# EAGLE design Sensor_Board (EAGLE 9.6.2)
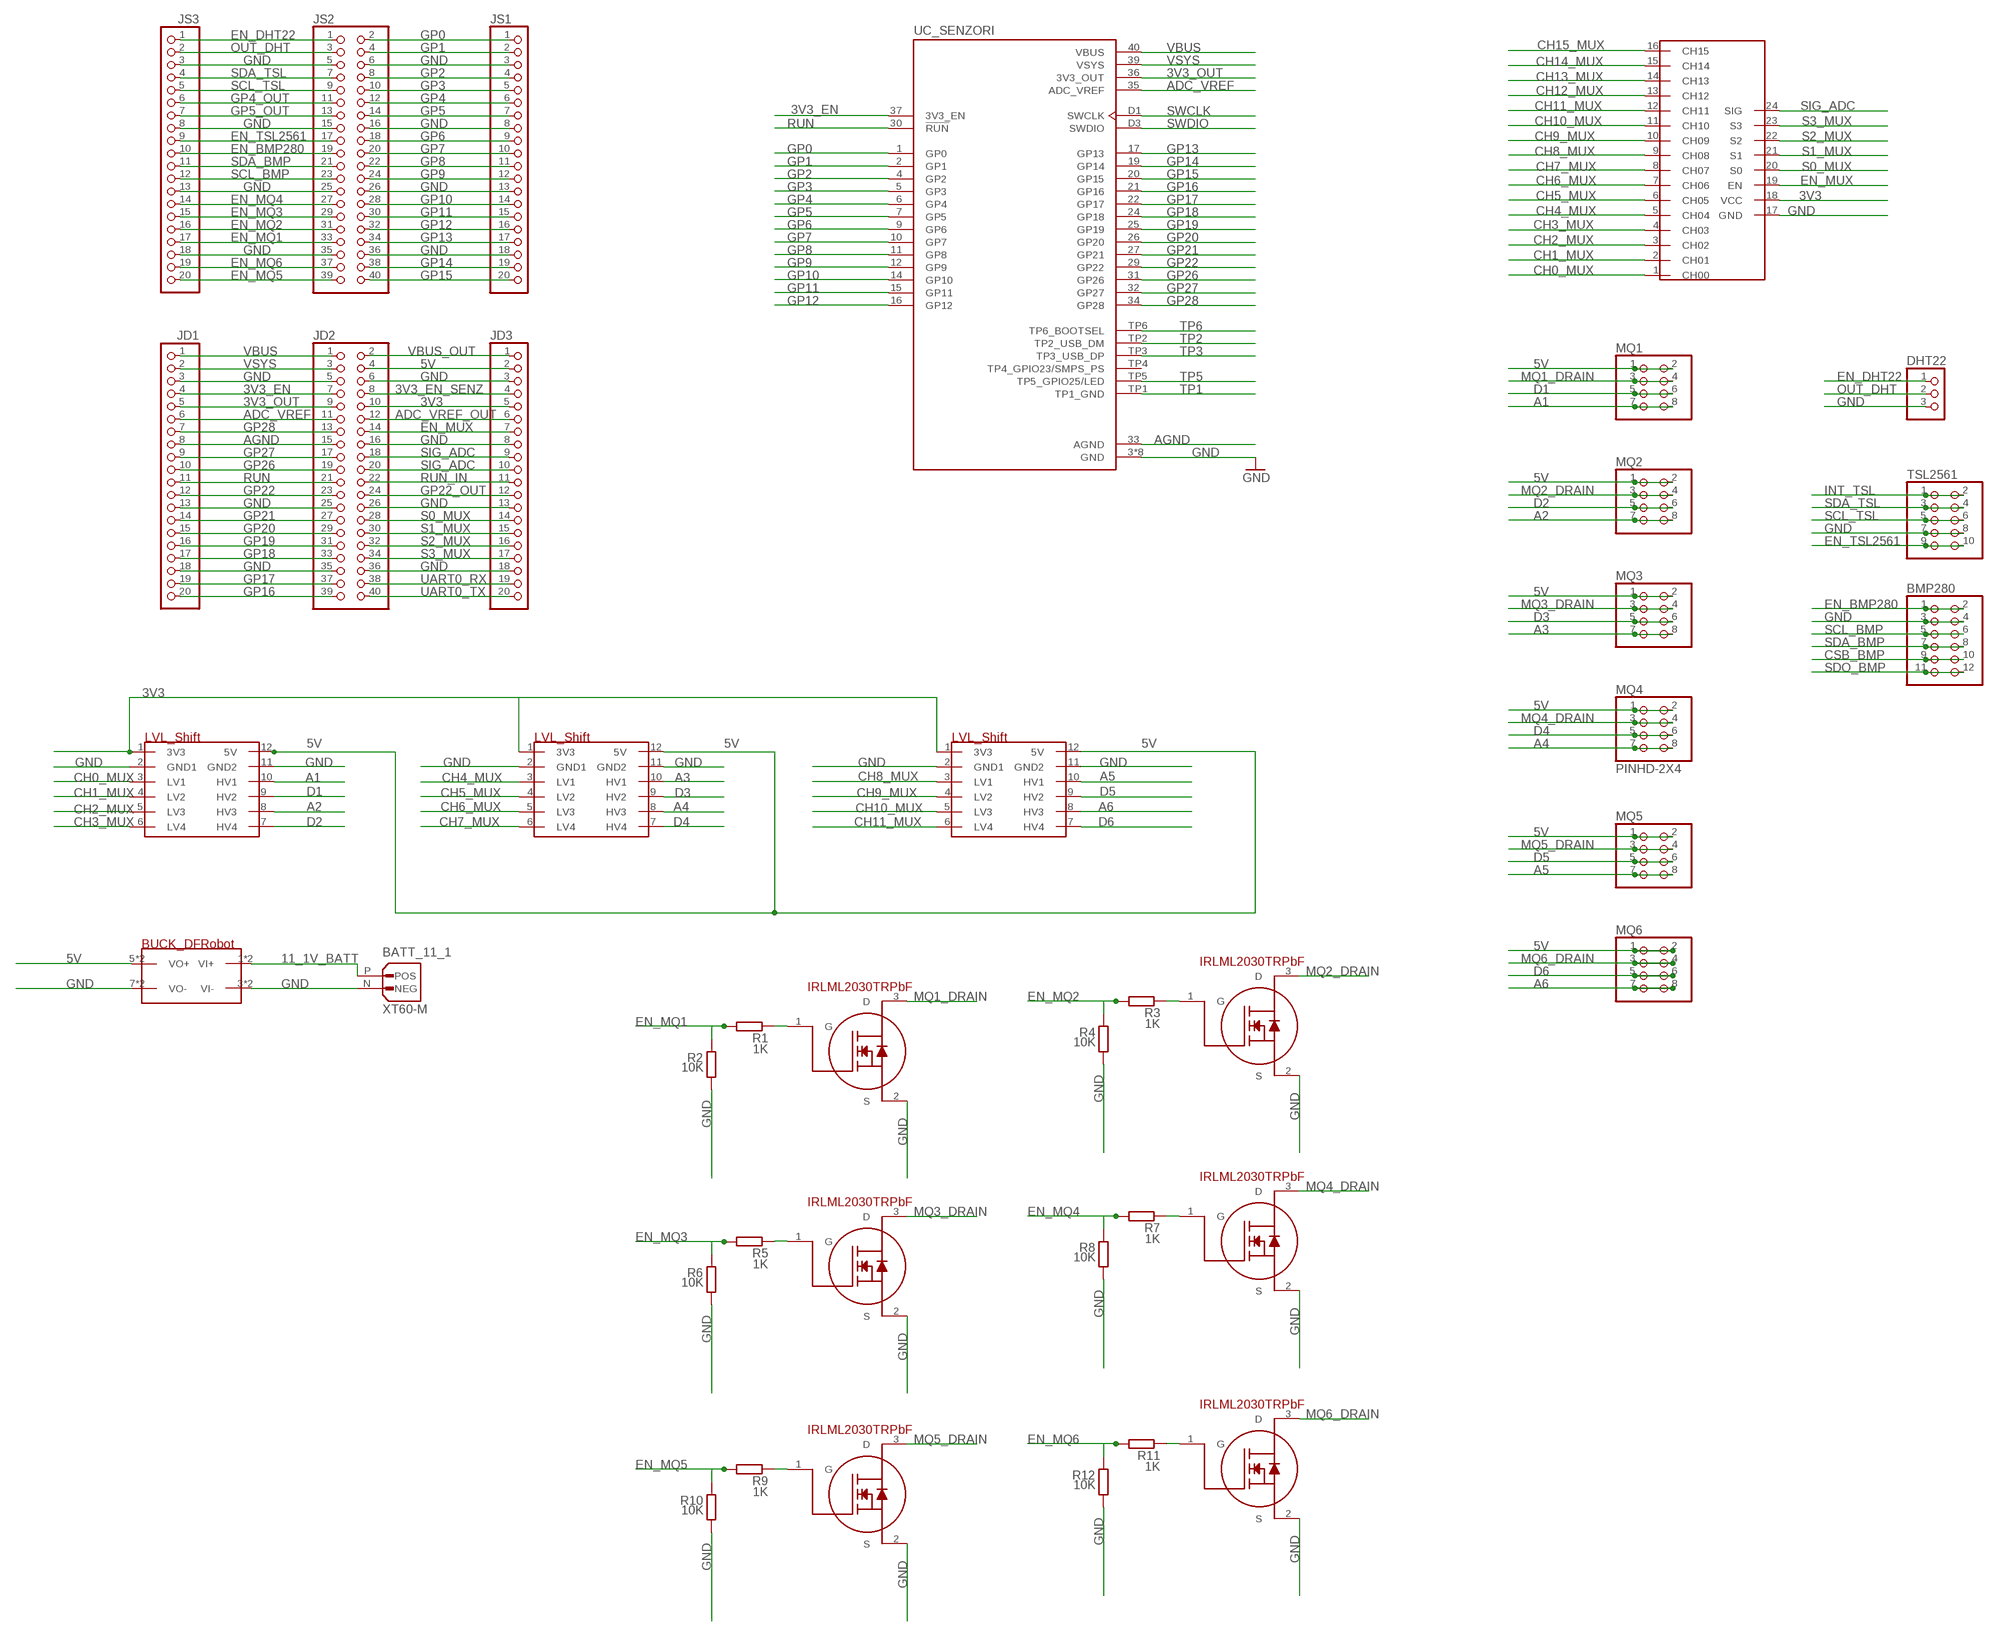
[diagram p0: schematic, sheet 1, part 1 of 2]
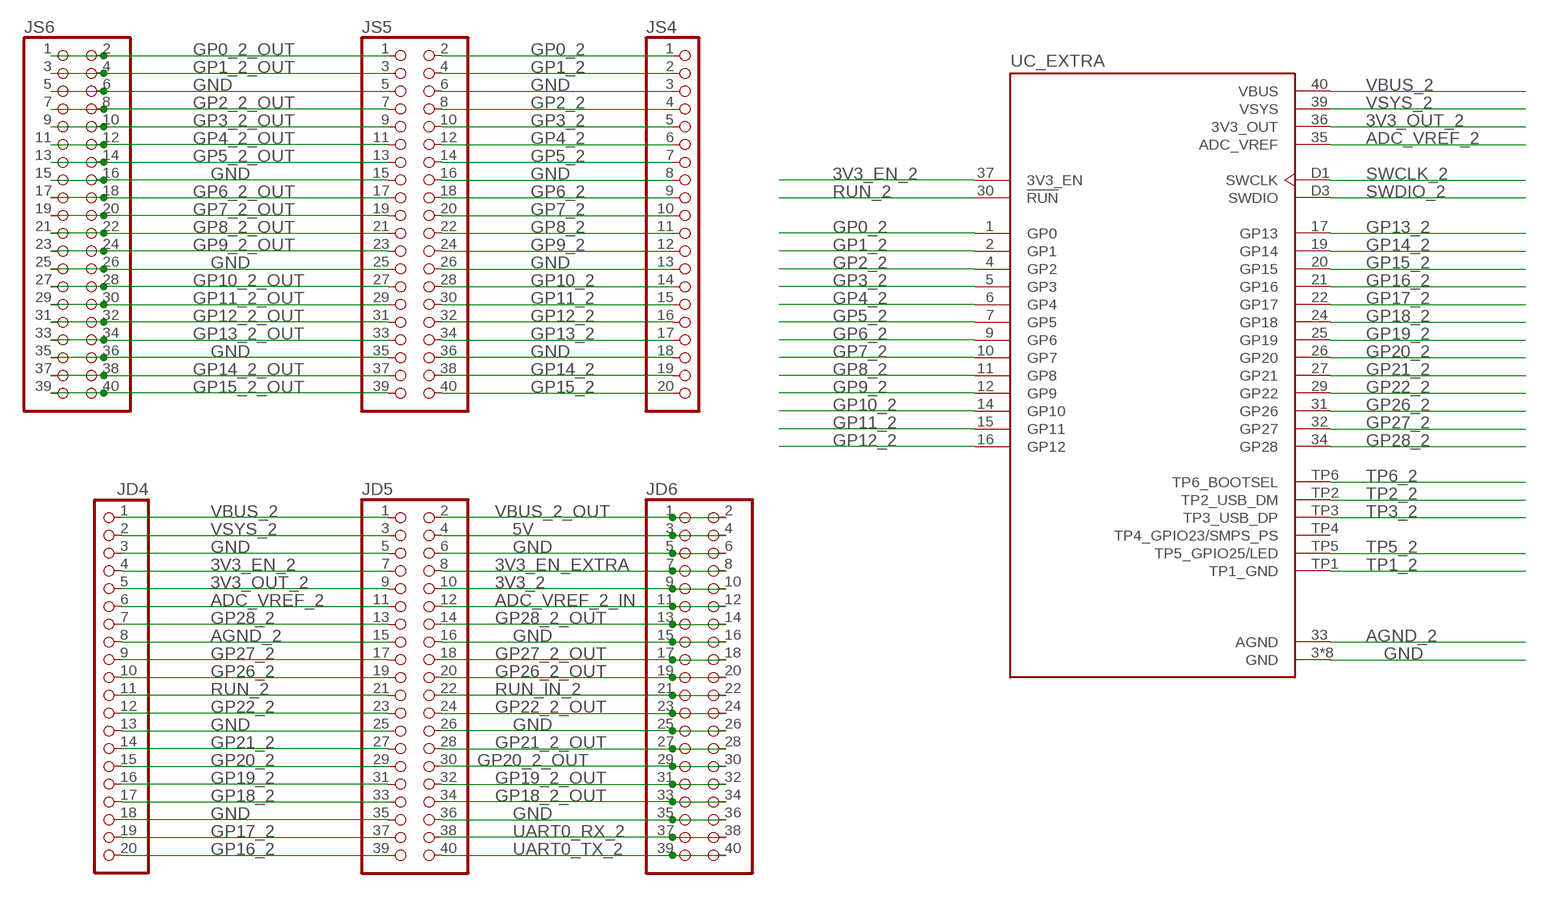
[diagram p1: schematic, sheet 1, part 2 of 2]

## Parts
BATT_11_1  XT60-M  [AMASS_XT60-M]
BMP280  PINHD-2X6  [2X06]
DHT22  PINHD-1X3  [1X03]
JD1  PINHD-1X20  [1X20]
JD2  PINHD-2X20  [2X20]
JD3  PINHD-1X20  [1X20]
JD4  PINHD-1X20  [1X20]
JD5  PINHD-2X20  [2X20]
JD6  PINHD-2X20  [2X20]
JS1  PINHD-1X20  [1X20]
JS2  PINHD-2X20  [2X20]
JS3  PINHD-1X20  [1X20]
JS4  PINHD-1X20  [1X20]
JS5  PINHD-2X20  [2X20]
JS6  PINHD-2X20  [2X20]
MQ1  PINHD-2X4  [2X04]
MQ2  PINHD-2X4  [2X04]
MQ3  PINHD-2X4  [2X04]
MQ4  PINHD-2X4  [2X04]
MQ5  PINHD-2X4  [2X04]
MQ6  PINHD-2X4  [2X04]
MUX  CD74HC4067_MUX  [16_CH_MUX_FOOTPRINT]
R1  1K  R-EU_R0805  [R0805]
R2  10K  R-EU_R0805  [R0805]
R3  1K  R-EU_R0805  [R0805]
R4  10K  R-EU_R0805  [R0805]
R5  1K  R-EU_R0805  [R0805]
R6  10K  R-EU_R0805  [R0805]
R7  1K  R-EU_R0805  [R0805]
R8  10K  R-EU_R0805  [R0805]
R9  1K  R-EU_R0805  [R0805]
R10  10K  R-EU_R0805  [R0805]
R11  1K  R-EU_R0805  [R0805]
R12  10K  R-EU_R0805  [R0805]
TSL2561  PINHD-2X5  [2X05]
U$1  IRLML2030TRBRBF_NMOS  [IRLML2030TRPBF_FOOTPRINT]
U$2  4_CH_BIDIRECTIONAL_LVL_SHIFTER  [LVL_SHIFT_FOOTPRINT]
U$3  4_CH_BIDIRECTIONAL_LVL_SHIFTER  [LVL_SHIFT_FOOTPRINT]
U$4  4_CH_BIDIRECTIONAL_LVL_SHIFTER  [LVL_SHIFT_FOOTPRINT]
U$5  DFROBOT_BUCK_CONVERTER  [DFROBOT_BUCK_FOOTPRINT]
U$7  IRLML2030TRBRBF_NMOS  [IRLML2030TRPBF_FOOTPRINT]
U$8  IRLML2030TRBRBF_NMOS  [IRLML2030TRPBF_FOOTPRINT]
U$9  IRLML2030TRBRBF_NMOS  [IRLML2030TRPBF_FOOTPRINT]
U$10  IRLML2030TRBRBF_NMOS  [IRLML2030TRPBF_FOOTPRINT]
U$11  IRLML2030TRBRBF_NMOS  [IRLML2030TRPBF_FOOTPRINT]
UC_EXTRA  SC0915  [MODULE_SC0915]
UC_SENZORI  SC0915  [MODULE_SC0915]

## Nets
3V3: JD2.10 JD3.5 MUX.18(VCC) U$2.1(3V3) U$3.1(3V3) U$4.1(3V3)
3V3_2: JD5.10 JD6.9 JD6.10
3V3_EN: JD1.4 JD2.7 UC_SENZORI.37(3V3_EN)
3V3_EN_2: JD4.4 JD5.7 UC_EXTRA.37(3V3_EN)
3V3_EN_EXTRA: JD5.8 JD6.7 JD6.8
3V3_EN_SENZ: JD2.8 JD3.4
3V3_OUT: JD1.5 JD2.9 UC_SENZORI.36(3V3_OUT)
3V3_OUT_2: JD4.5 JD5.9 UC_EXTRA.36(3V3_OUT)
5V: JD2.4 JD3.2 JD5.4 JD6.3 JD6.4 MQ1.1 MQ1.2 MQ2.1 MQ2.2 MQ3.1 MQ3.2 MQ4.1 MQ4.2 MQ5.1 MQ5.2 MQ6.1 MQ6.2 U$2.12(5V) U$3.12(5V) U$4.12(5V) U$5.5(VO+) U$5.6(VO+)
11_1V_BATT: BATT_11_1.P(POS) U$5.1(VI+) U$5.2(VI+)
A1: MQ1.7 MQ1.8 U$2.10(HV1)
A2: MQ2.7 MQ2.8 U$2.8(HV3)
A3: MQ3.7 MQ3.8 U$3.10(HV1)
A4: MQ4.7 MQ4.8 U$3.8(HV3)
A5: MQ5.7 MQ5.8 U$4.10(HV1)
A6: MQ6.7 MQ6.8 U$4.8(HV3)
ADC_VREF: JD1.6 JD2.11 UC_SENZORI.35(ADC_VREF)
ADC_VREF_2: JD4.6 JD5.11 UC_EXTRA.35(ADC_VREF)
ADC_VREF_2_IN: JD5.12 JD6.11 JD6.12
ADC_VREF_OUT: JD2.12 JD3.6
AGND: JD1.8 JD2.15 UC_SENZORI.33(AGND)
AGND_2: JD4.8 JD5.15 UC_EXTRA.33(AGND)
CH0_MUX: MUX.1(CH00) U$2.3(LV1)
CH1_MUX: MUX.2(CH01) U$2.4(LV2)
CH2_MUX: MUX.3(CH02) U$2.5(LV3)
CH3_MUX: MUX.4(CH03) U$2.6(LV4)
CH4_MUX: MUX.5(CH04) U$3.3(LV1)
CH5_MUX: MUX.6(CH05) U$3.4(LV2)
CH6_MUX: MUX.7(CH06) U$3.5(LV3)
CH7_MUX: MUX.8(CH07) U$3.6(LV4)
CH8_MUX: MUX.9(CH08) U$4.3(LV1)
CH9_MUX: MUX.10(CH09) U$4.4(LV2)
CH10_MUX: MUX.11(CH10) U$4.5(LV3)
CH11_MUX: MUX.12(CH11) U$4.6(LV4)
CH12_MUX: MUX.13(CH12)
CH13_MUX: MUX.14(CH13)
CH14_MUX: MUX.15(CH14)
CH15_MUX: MUX.16(CH15)
CSB_BMP: BMP280.9 BMP280.10
D1: MQ1.5 MQ1.6 U$2.9(HV2)
D2: MQ2.5 MQ2.6 U$2.7(HV4)
D3: MQ3.5 MQ3.6 U$3.9(HV2)
D4: MQ4.5 MQ4.6 U$3.7(HV4)
D5: MQ5.5 MQ5.6 U$4.9(HV2)
D6: MQ6.5 MQ6.6 U$4.7(HV4)
EN_BMP280: BMP280.1 BMP280.2 JS2.19 JS3.10
EN_DHT22: DHT22.1 JS2.1 JS3.1
EN_MQ1: JS2.33 JS3.17 R1.2 R2.2
EN_MQ2: JS2.31 JS3.16 R3.2 R4.2
EN_MQ3: JS2.29 JS3.15 R5.2 R6.2
EN_MQ4: JS2.27 JS3.14 R7.2 R8.2
EN_MQ5: JS2.39 JS3.20 R9.2 R10.2
EN_MQ6: JS2.37 JS3.19 R11.2 R12.2
EN_MUX: JD2.14 JD3.7 MUX.19(EN)
EN_TSL2561: JS2.17 JS3.9 TSL2561.9 TSL2561.10
GND: BATT_11_1.N(NEG) BMP280.3 BMP280.4 DHT22.3 JD1.3 JD1.13 JD1.18 JD2.5 JD2.6 JD2.16 JD2.25 JD2.26 JD2.35 JD2.36 JD3.3 JD3.8 JD3.13 JD3.18 JD4.3 JD4.13 JD4.18 JD5.5 JD5.6 JD5.16 JD5.25 JD5.26 JD5.35 JD5.36 JD6.5 JD6.6 JD6.15 JD6.16 JD6.25 JD6.26 JD6.35 JD6.36 JS1.3 JS1.8 JS1.13 JS1.18 JS2.5 JS2.6 JS2.15 JS2.16 JS2.25 JS2.26 JS2.35 JS2.36 JS3.3 JS3.8 JS3.13 JS3.18 JS4.3 JS4.8 JS4.13 JS4.18 JS5.5 JS5.6 JS5.15 JS5.16 JS5.25 JS5.26 JS5.35 JS5.36 JS6.5 JS6.6 JS6.15 JS6.16 JS6.25 JS6.26 JS6.35 JS6.36 MUX.17(GND) R2.1 R4.1 R6.1 R8.1 R10.1 R12.1 TSL2561.7 TSL2561.8 U$1.2(S) U$2.2(GND1) U$2.11(GND2) U$3.2(GND1) U$3.11(GND2) U$4.2(GND1) U$4.11(GND2) U$5.3(VI-) U$5.4(VI-) U$5.7(VO-) U$5.8(VO-) U$7.2(S) U$8.2(S) U$9.2(S) U$10.2(S) U$11.2(S) UC_EXTRA.3(GND) UC_EXTRA.8(GND) UC_EXTRA.13(GND) UC_EXTRA.18(GND) UC_EXTRA.23(GND) UC_EXTRA.28(GND) UC_EXTRA.38(GND) UC_EXTRA.D2(GND) UC_SENZORI.3(GND) UC_SENZORI.8(GND) UC_SENZORI.13(GND) UC_SENZORI.18(GND) UC_SENZORI.23(GND) UC_SENZORI.28(GND) UC_SENZORI.38(GND) UC_SENZORI.D2(GND)
GP0: JS1.1 JS2.2 UC_SENZORI.1(GP0)
GP0_2: JS4.1 JS5.2 UC_EXTRA.1(GP0)
GP0_2_OUT: JS5.1 JS6.1 JS6.2
GP1: JS1.2 JS2.4 UC_SENZORI.2(GP1)
GP1_2: JS4.2 JS5.4 UC_EXTRA.2(GP1)
GP1_2_OUT: JS5.3 JS6.3 JS6.4
GP2: JS1.4 JS2.8 UC_SENZORI.4(GP2)
GP2_2: JS4.4 JS5.8 UC_EXTRA.4(GP2)
GP2_2_OUT: JS5.7 JS6.7 JS6.8
GP3: JS1.5 JS2.10 UC_SENZORI.5(GP3)
GP3_2: JS4.5 JS5.10 UC_EXTRA.5(GP3)
GP3_2_OUT: JS5.9 JS6.9 JS6.10
GP4: JS1.6 JS2.12 UC_SENZORI.6(GP4)
GP4_2: JS4.6 JS5.12 UC_EXTRA.6(GP4)
GP4_2_OUT: JS5.11 JS6.11 JS6.12
GP4_OUT: JS2.11 JS3.6
GP5: JS1.7 JS2.14 UC_SENZORI.7(GP5)
GP5_2: JS4.7 JS5.14 UC_EXTRA.7(GP5)
GP5_2_OUT: JS5.13 JS6.13 JS6.14
GP5_OUT: JS2.13 JS3.7
GP6: JS1.9 JS2.18 UC_SENZORI.9(GP6)
GP6_2: JS4.9 JS5.18 UC_EXTRA.9(GP6)
GP6_2_OUT: JS5.17 JS6.17 JS6.18
GP7: JS1.10 JS2.20 UC_SENZORI.10(GP7)
GP7_2: JS4.10 JS5.20 UC_EXTRA.10(GP7)
GP7_2_OUT: JS5.19 JS6.19 JS6.20
GP8: JS1.11 JS2.22 UC_SENZORI.11(GP8)
GP8_2: JS4.11 JS5.22 UC_EXTRA.11(GP8)
GP8_2_OUT: JS5.21 JS6.21 JS6.22
GP9: JS1.12 JS2.24 UC_SENZORI.12(GP9)
GP9_2: JS4.12 JS5.24 UC_EXTRA.12(GP9)
GP9_2_OUT: JS5.23 JS6.23 JS6.24
GP10: JS1.14 JS2.28 UC_SENZORI.14(GP10)
GP10_2: JS4.14 JS5.28 UC_EXTRA.14(GP10)
GP10_2_OUT: JS5.27 JS6.27 JS6.28
GP11: JS1.15 JS2.30 UC_SENZORI.15(GP11)
GP11_2: JS4.15 JS5.30 UC_EXTRA.15(GP11)
GP11_2_OUT: JS5.29 JS6.29 JS6.30
GP12: JS1.16 JS2.32 UC_SENZORI.16(GP12)
GP12_2: JS4.16 JS5.32 UC_EXTRA.16(GP12)
GP12_2_OUT: JS5.31 JS6.31 JS6.32
GP13: JS1.17 JS2.34 UC_SENZORI.17(GP13)
GP13_2: JS4.17 JS5.34 UC_EXTRA.17(GP13)
GP13_2_OUT: JS5.33 JS6.33 JS6.34
GP14: JS1.19 JS2.38 UC_SENZORI.19(GP14)
GP14_2: JS4.19 JS5.38 UC_EXTRA.19(GP14)
GP14_2_OUT: JS5.37 JS6.37 JS6.38
GP15: JS1.20 JS2.40 UC_SENZORI.20(GP15)
GP15_2: JS4.20 JS5.40 UC_EXTRA.20(GP15)
GP15_2_OUT: JS5.39 JS6.39 JS6.40
GP16: JD1.20 JD2.39 UC_SENZORI.21(GP16)
GP16_2: JD4.20 JD5.39 UC_EXTRA.21(GP16)
GP17: JD1.19 JD2.37 UC_SENZORI.22(GP17)
GP17_2: JD4.19 JD5.37 UC_EXTRA.22(GP17)
GP18: JD1.17 JD2.33 UC_SENZORI.24(GP18)
GP18_2: JD4.17 JD5.33 UC_EXTRA.24(GP18)
GP18_2_OUT: JD5.34 JD6.33 JD6.34
GP19: JD1.16 JD2.31 UC_SENZORI.25(GP19)
GP19_2: JD4.16 JD5.31 UC_EXTRA.25(GP19)
GP19_2_OUT: JD5.32 JD6.31 JD6.32
GP20: JD1.15 JD2.29 UC_SENZORI.26(GP20)
GP20_2: JD4.15 JD5.29 UC_EXTRA.26(GP20)
GP20_2_OUT: JD5.30 JD6.29 JD6.30
GP21: JD1.14 JD2.27 UC_SENZORI.27(GP21)
GP21_2: JD4.14 JD5.27 UC_EXTRA.27(GP21)
GP21_2_OUT: JD5.28 JD6.27 JD6.28
GP22: JD1.12 JD2.23 UC_SENZORI.29(GP22)
GP22_2: JD4.12 JD5.23 UC_EXTRA.29(GP22)
GP22_2_OUT: JD5.24 JD6.23 JD6.24
GP22_OUT: JD2.24 JD3.12
GP26: JD1.10 JD2.19 UC_SENZORI.31(GP26)
GP26_2: JD4.10 JD5.19 UC_EXTRA.31(GP26)
GP26_2_OUT: JD5.20 JD6.19 JD6.20
GP27: JD1.9 JD2.17 UC_SENZORI.32(GP27)
GP27_2: JD4.9 JD5.17 UC_EXTRA.32(GP27)
GP27_2_OUT: JD5.18 JD6.17 JD6.18
GP28: JD1.7 JD2.13 UC_SENZORI.34(GP28)
GP28_2: JD4.7 JD5.13 UC_EXTRA.34(GP28)
GP28_2_OUT: JD5.14 JD6.13 JD6.14
INT_TSL: TSL2561.1 TSL2561.2
MQ1_DRAIN: MQ1.3 MQ1.4 U$1.3(D)
MQ2_DRAIN: MQ2.3 MQ2.4 U$7.3(D)
MQ3_DRAIN: MQ3.3 MQ3.4 U$8.3(D)
MQ4_DRAIN: MQ4.3 MQ4.4 U$9.3(D)
MQ5_DRAIN: MQ5.3 MQ5.4 U$10.3(D)
MQ6_DRAIN: MQ6.3 MQ6.4 U$11.3(D)
N$121: R1.1 U$1.1(G)
N$186: R3.1 U$7.1(G)
N$189: R5.1 U$8.1(G)
N$277: R7.1 U$9.1(G)
N$332: R9.1 U$10.1(G)
N$338: R11.1 U$11.1(G)
OUT_DHT: DHT22.2 JS2.3 JS3.2
RUN: JD1.11 JD2.21 UC_SENZORI.30(!RUN)
RUN_2: JD4.11 JD5.21 UC_EXTRA.30(!RUN)
RUN_IN: JD2.22 JD3.11
RUN_IN_2: JD5.22 JD6.21 JD6.22
S0_MUX: JD2.28 JD3.14 MUX.20(S0)
S1_MUX: JD2.30 JD3.15 MUX.21(S1)
S2_MUX: JD2.32 JD3.16 MUX.22(S2)
S3_MUX: JD2.34 JD3.17 MUX.23(S3)
SCL_BMP: BMP280.5 BMP280.6 JS2.23 JS3.12
SCL_TSL: JS2.9 JS3.5 TSL2561.5 TSL2561.6
SDA_BMP: BMP280.7 BMP280.8 JS2.21 JS3.11
SDA_TSL: JS2.7 JS3.4 TSL2561.3 TSL2561.4
SDO_BMP: BMP280.11 BMP280.12
SIG_ADC: JD2.18 JD2.20 JD3.9 JD3.10 MUX.24(SIG)
SWCLK: UC_SENZORI.D1(SWCLK)
SWCLK_2: UC_EXTRA.D1(SWCLK)
SWDIO: UC_SENZORI.D3(SWDIO)
SWDIO_2: UC_EXTRA.D3(SWDIO)
TP1: UC_SENZORI.TP1(TP1_GND)
TP1_2: UC_EXTRA.TP1(TP1_GND)
TP2: UC_SENZORI.TP2(TP2_USB_DM)
TP2_2: UC_EXTRA.TP2(TP2_USB_DM)
TP3: UC_SENZORI.TP3(TP3_USB_DP)
TP3_2: UC_EXTRA.TP3(TP3_USB_DP)
TP5: UC_SENZORI.TP5(TP5_GPIO25/LED)
TP5_2: UC_EXTRA.TP5(TP5_GPIO25/LED)
TP6: UC_SENZORI.TP6(TP6_BOOTSEL)
TP6_2: UC_EXTRA.TP6(TP6_BOOTSEL)
UART0_RX: JD2.38 JD3.19
UART0_RX_2: JD5.38 JD6.37 JD6.38
UART0_TX: JD2.40 JD3.20
UART0_TX_2: JD5.40 JD6.39 JD6.40
VBUS: JD1.1 JD2.1 UC_SENZORI.40(VBUS)
VBUS_2: JD4.1 JD5.1 UC_EXTRA.40(VBUS)
VBUS_2_OUT: JD5.2 JD6.1 JD6.2
VBUS_OUT: JD2.2 JD3.1
VSYS: JD1.2 JD2.3 UC_SENZORI.39(VSYS)
VSYS_2: JD4.2 JD5.3 UC_EXTRA.39(VSYS)
Unconnected: UC_EXTRA.TP4(TP4_GPIO23/SMPS_PS) UC_SENZORI.TP4(TP4_GPIO23/SMPS_PS)

## Library data of the parts
BATT_11_1 = XT60-M:XT60-M; MANUFACTURER: AMASS; MAXIMUM_PACKAGE_HEIGHT: 16.00 mm; PARTREV: V1.2; STANDARD: IPC 7351B
BMP280 = Connector:PINHD-2X6: PIN HEADER; CATEGORY: CONNECTOR; SUB-CATEGORY: PIN-HEADER
DHT22 = Connector:PINHD-1X3: PIN HEADER; CATEGORY: CONNECTOR; SUB-CATEGORY: PIN-HEADER
JD1 JD3 JD4 JS1 JS3 JS4 = Connector:PINHD-1X20: PIN HEADER; CATEGORY: CONNECTOR; SUB-CATEGORY: PIN-HEADER
JD2 JD5 JD6 JS2 JS5 JS6 = Connector:PINHD-2X20: PIN HEADER; CATEGORY: CONNECTOR; SUB-CATEGORY: PIN-HEADER
MQ1-MQ6 = Connector:PINHD-2X4: PIN HEADER; CATEGORY: CONNECTOR; SUB-CATEGORY: PIN-HEADER
MUX = Step_Down:CD74HC4067_MUX
R1-R12 = rcl:R-EU_: RESISTOR, European symbol; SPICEPREFIX: R
TSL2561 = Connector:PINHD-2X5: PIN HEADER; CATEGORY: CONNECTOR; SUB-CATEGORY: PIN-HEADER
U$1 U$7-U$11 = SMD_Tranzistor:IRLML2030TRBRBF_NMOS
U$2-U$4 = Step_Down:4_CH_BIDIRECTIONAL_LVL_SHIFTER
U$5 = Step_Down:DFROBOT_BUCK_CONVERTER
UC_EXTRA UC_SENZORI = SC0915:SC0915: Check availability <https://pricing.snapeda.com/parts/SC0915/Raspberry%20Pi/view-part?ref=eda>; AVAILABILITY: In Stock; DESCRIPTION: RP2040 Raspberry Pi Pico series ARM® Cortex®-M0+ MCU 32-Bit Embedded Evaluation Board; MF: Raspberry Pi; MP: SC0915; PACKAGE: None; PRICE: None; PURCHASE-URL: https://pricing.snapeda.com/search/part/SC0915/?ref=eda

## Board
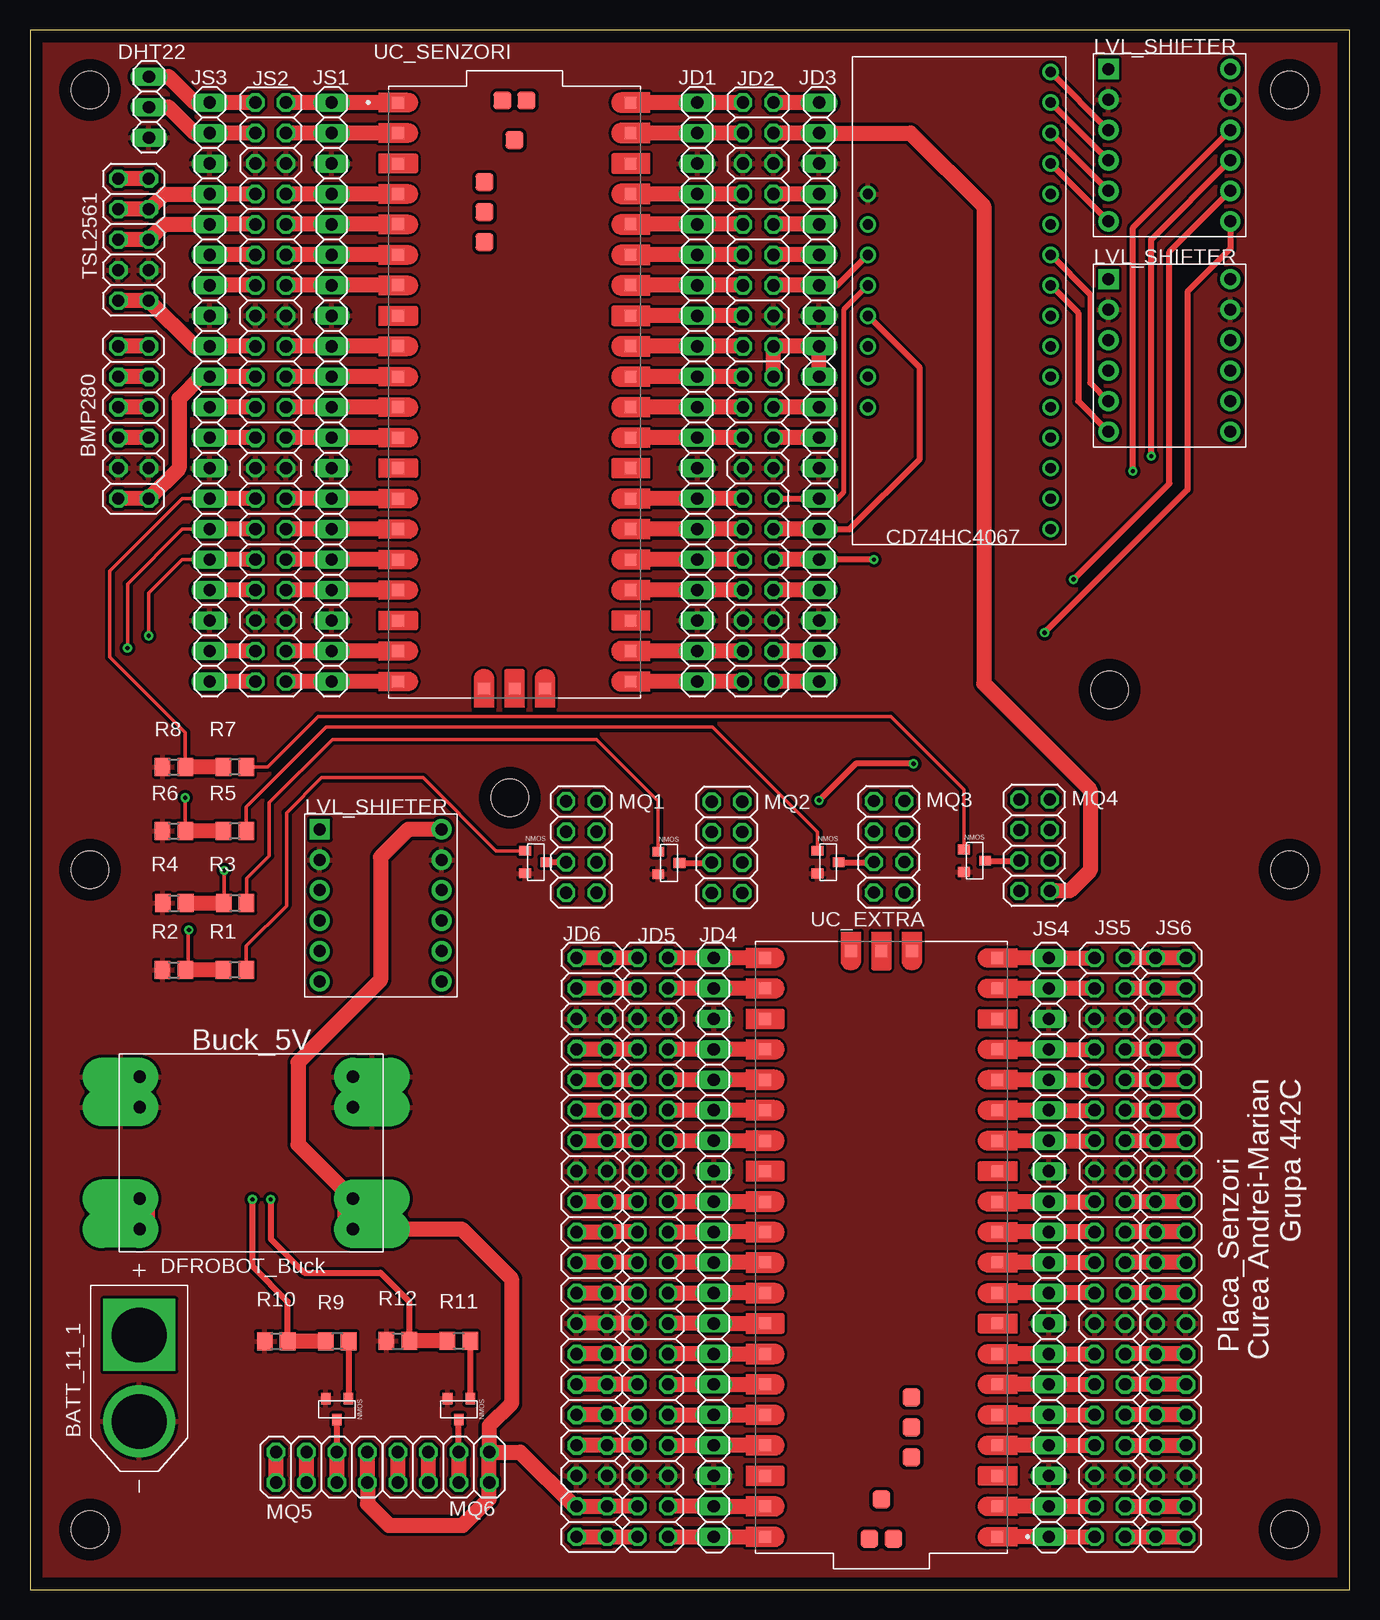
[diagram p2: board, top side]
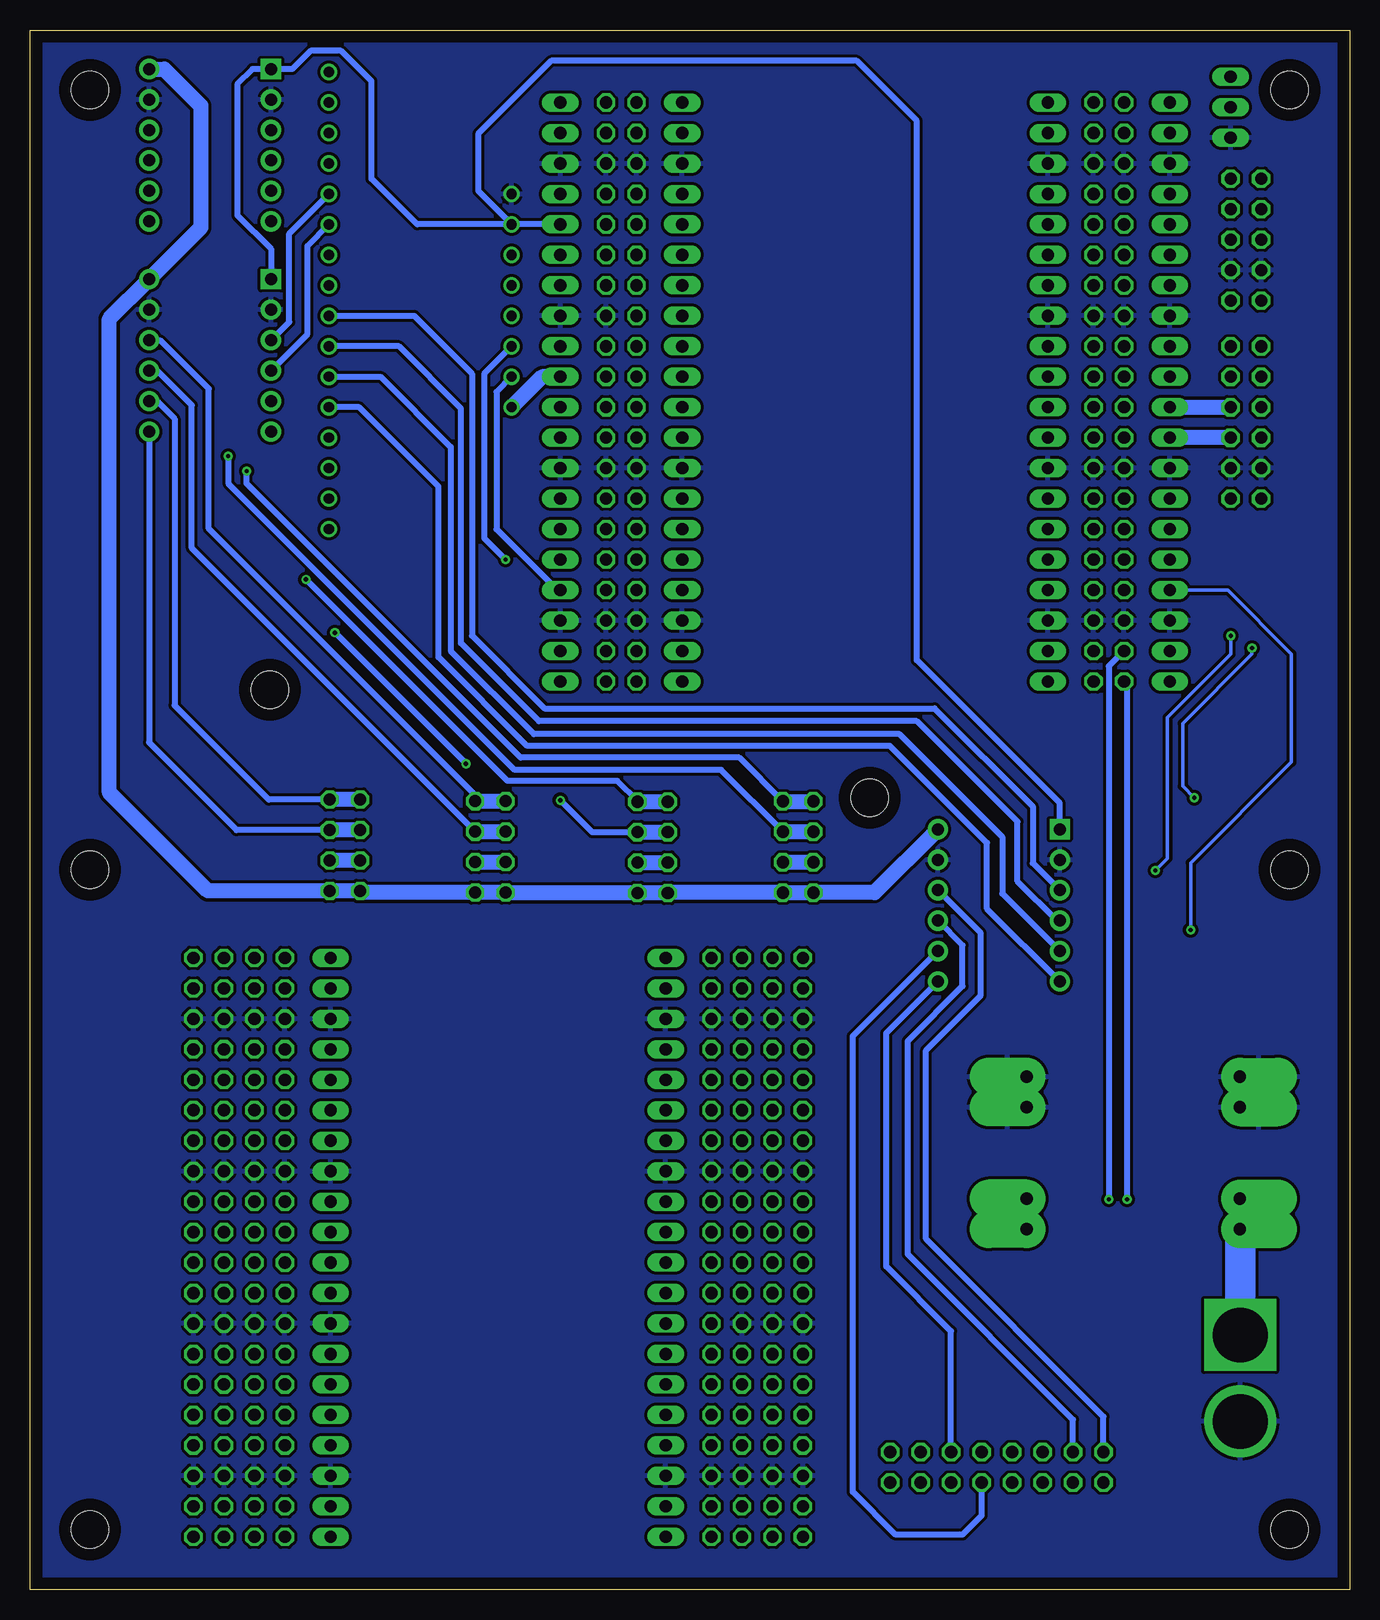
[diagram p3: board, bottom side, seen from below]

Size 110 x 130 mm. Coordinates in mm from the lower left corner, seen from the top.
Outline: 0,0 110,0 110,130 0,130 0,0
Copper layers (1*16): Top 0.035mm / dielectric 1.5mm / Bottom 0.035mm
Design rules "default *": minimum track width 8mil, minimum drill 0.35mm, track to track 8mil, track to pad 8mil, pad to pad 8mil, via to via 8mil, smd to smd 8mil, copper to edge 40mil, drill to drill 10mil, minimum pad ring 10mil, minimum via ring 8mil, stop-mask expansion 4mil, vias tented up to drill 0mil, thermal gap 10mil
Holes 3.1 mm at 105,125 105,5 105,60 5,5 5,60 5,125 40,66 90,75

### Footprints (pad centres in the part's own frame; a part is rotated, then mirrored left to right if it is on the bottom)
AMASS_XT60-M = drill 4.55 pad 6: N 3.6,0 | drill 4.55 pad 6 square: P -3.6,0
2X06 = drill 1.016 octagon: 1 -6.35,-1.27; 2 -6.35,1.27; 3 -3.81,-1.27; 4 -3.81,1.27; 5 -1.27,-1.27; 6 -1.27,1.27; 7 1.27,-1.27; 8 1.27,1.27; 9 3.81,-1.27; 10 3.81,1.27; 11 6.35,-1.27; 12 6.35,1.27
1X03 = drill 1.016 long: 1 -2.54,0; 2 0,0; 3 2.54,0
1X20 = drill 1.016 long: 1 -24.13,0; 2 -21.59,0; 3 -19.05,0; 4 -16.51,0; 5 -13.97,0; 6 -11.43,0; 7 -8.89,0; 8 -6.35,0; 9 -3.81,0; 10 -1.27,0; 11 1.27,0; 12 3.81,0; 13 6.35,0; 14 8.89,0; 15 11.43,0; 16 13.97,0; 17 16.51,0; 18 19.05,0; 19 21.59,0; 20 24.13,0
2X20 = drill 1.016 octagon: 1 -24.13,-1.27; 2 -24.13,1.27; 3 -21.59,-1.27; 4 -21.59,1.27; 5 -19.05,-1.27; 6 -19.05,1.27; 7 -16.51,-1.27; 8 -16.51,1.27; 9 -13.97,-1.27; 10 -13.97,1.27; 11 -11.43,-1.27; 12 -11.43,1.27; 13 -8.89,-1.27; 14 -8.89,1.27; 15 -6.35,-1.27; 16 -6.35,1.27; 17 -3.81,-1.27; 18 -3.81,1.27; 19 -1.27,-1.27; 20 -1.27,1.27; 21 1.27,-1.27; 22 1.27,1.27; 23 3.81,-1.27; 24 3.81,1.27; 25 6.35,-1.27; 26 6.35,1.27; 27 8.89,-1.27; 28 8.89,1.27; 29 11.43,-1.27; 30 11.43,1.27; 31 13.97,-1.27; 32 13.97,1.27; 33 16.51,-1.27; 34 16.51,1.27; 35 19.05,-1.27; 36 19.05,1.27; 37 21.59,-1.27; 38 21.59,1.27; 39 24.13,-1.27; 40 24.13,1.27
2X04 = drill 1.016 octagon: 1 -3.81,-1.27; 2 -3.81,1.27; 3 -1.27,-1.27; 4 -1.27,1.27; 5 1.27,-1.27; 6 1.27,1.27; 7 3.81,-1.27; 8 3.81,1.27
16_CH_MUX_FOOTPRINT = drill 0.85: 1 1.27,1.27; 2 1.27,3.81; 3 1.27,6.35; 4 1.27,8.89; 5 1.27,11.43; 6 1.27,13.97; 7 1.27,16.51; 8 1.27,19.05; 9 1.27,21.59; 10 1.27,24.13; 11 1.27,26.67; 12 1.27,29.21; 13 1.27,31.75; 14 1.27,34.29; 15 1.27,36.83; 16 1.27,39.37; 17 16.51,11.43; 18 16.51,13.97; 19 16.51,16.51; 20 16.51,19.05; 21 16.51,21.59; 22 16.51,24.13; 23 16.51,26.67; 24 16.51,29.21
R0805 = smd 1.3 x 1.5: 1 -0.95,0; 2 0.95,0
2X05 = drill 1.016 octagon: 1 -5.08,-1.27; 2 -5.08,1.27; 3 -2.54,-1.27; 4 -2.54,1.27; 5 0,-1.27; 6 0,1.27; 7 2.54,-1.27; 8 2.54,1.27; 9 5.08,-1.27; 10 5.08,1.27
IRLML2030TRPBF_FOOTPRINT = smd 0.802 x 0.972: 1 0.575,-0.2; 2 2.458,-0.2; 3 1.525,1.57
LVL_SHIFT_FOOTPRINT = drill 1 pad 1.676 square: 1 1.27,13.97 | drill 1 pad 1.676: 2 1.27,11.43; 3 1.27,8.89; 4 1.27,6.35; 5 1.27,3.81; 6 1.27,1.27; 7 11.43,1.27; 8 11.43,3.81; 9 11.43,6.35; 10 11.43,8.89; 11 11.43,11.43; 12 11.43,13.97
DFROBOT_BUCK_FOOTPRINT = drill 1.016 pad 3.175 offset: 1 1.905,20.32; 2 4.445,20.32; 3 12.065,20.32; 4 14.605,20.32; 5 1.905,2.54; 6 4.445,2.54; 7 12.065,2.54; 8 14.605,2.54
MODULE_SC0915 = smd 1 x 1: 1 -9.69,24.13; 2 -9.69,21.59; 3 -9.69,19.05; 4 -9.69,16.51; 5 -9.69,13.97; 6 -9.69,11.43; 7 -9.69,8.89; 8 -9.69,6.35; 9 -9.69,3.81; 10 -9.69,1.27; 11 -9.69,-1.27; 12 -9.69,-3.81; 13 -9.69,-6.35; 14 -9.69,-8.89; 15 -9.69,-11.43; 16 -9.69,-13.97; 17 -9.69,-16.51; 18 -9.69,-19.05; 19 -9.69,-21.59; 20 -9.69,-24.13; 21 9.69,-24.13; 22 9.69,-21.59; 23 9.69,-19.05; 24 9.69,-16.51; 25 9.69,-13.97; 26 9.69,-11.43; 27 9.69,-8.89; 28 9.69,-6.35; 29 9.69,-3.81; 30 9.69,-1.27; 31 9.69,1.27; 32 9.69,3.81; 33 9.69,6.35; 34 9.69,8.89; 35 9.69,11.43; 36 9.69,13.97; 37 9.69,16.51; 38 9.69,19.05; 39 9.69,21.59; 40 9.69,24.13; D1 -2.54,-24.7; D2 0,-24.7; D3 2.54,-24.7 | smd 1.5 x 1.5: TP1 0,21; TP2 1,24.3; TP3 -1,24.3; TP4 -2.5,17.5; TP5 -2.5,15; TP6 -2.5,12.5

### Placement (x,y rotation side)
BATT_11_1  9.11,17.61 270 top
BMP280  8.64,97.28 90 top
DHT22  9.91,123.57 270 top
JD1  55.63,99.82 270 top
JD2  60.71,99.82 270 top
JD3  65.79,99.82 270 top
JD4  57,28.52 90 top
JD5  51.92,28.52 90 top
JD6  46.84,28.52 90 top
JS1  25.15,99.82 270 top
JS2  20.07,99.82 270 top
JS3  14.99,99.82 270 top
JS4  84.94,28.52 90 top
JS5  90.02,28.52 90 top
JS6  95.1,28.52 90 top
MQ1  45.97,61.9 90 top
MQ2  58.1,61.86 90 top
MQ3  71.62,61.91 90 top
MQ4  83.75,62.04 90 top
MQ5  24.32,10.19 180 top
MQ6  34.48,10.19 180 top
MUX  86.36,127.76 180 top
R1  17.08,51.65 180 top
R2  12,51.65 0 top
R3  17.11,57.21 180 top
R4  12.03,57.21 0 top
R5  17.08,63.23 180 top
R6  12,63.23 0 top
R7  17.08,68.56 180 top
R8  12,68.56 0 top
R9  25.61,20.7 180 top
R10  20.53,20.7 0 top
R11  35.75,20.71 180 top
R12  30.67,20.71 0 top
TSL2561  8.64,112.52 270 top
U$1  41.47,62.16 270 top
U$2  88.65,112.78 0 top
U$3  88.65,95.25 0 top
U$4  22.89,49.4 0 top
U$5  29.46,28.14 90 top
U$7  52.57,62.09 270 top
U$8  65.85,62.15 270 top
U$9  78.05,62.27 270 top
U$10  27.11,15.73 180 top
U$11  37.27,15.73 180 top
UC_EXTRA  70.97,28.52 180 top
UC_SENZORI  40.39,99.82 0 top

### Tracks (layer width: path | path; a pad name or v marks a point on that pad's centre or on a via)
3V3
  Top 1.27: JD3.5 JD2.10
  Bottom 0.508: U$4.1 24.16,65.56 36.07,77.47 36.07,122.43 41.07,127.43 66.55,127.43 72.64,121.34 72.64,116.59 MUX.18 | JD3.5 MUX.18 | U$3.1 89.92,111.76 92.71,114.55 92.71,125.48 91.44,126.75 U$2.1 88.14,126.75 86.61,128.27 84.07,128.27 81.53,125.73 81.53,117.6 77.72,113.79 MUX.18
3V3_2
  Top 1.27: JD6.10 JD6.9 JD5.10
3V3_EN
  Top 1.27: UC_SENZORI.37 JD1.4 JD2.7
3V3_EN_2
  Top 1.27: UC_EXTRA.37 JD4.4 JD5.7
3V3_EN_EXTRA
  Top 1.27: JD6.8 JD6.7 JD5.8
3V3_EN_SENZ
  Top 1.27: JD3.4 JD2.8
3V3_OUT
  Top 1.27: UC_SENZORI.36 JD1.5 JD2.9
3V3_OUT_2
  Top 1.27: JD5.9 JD4.5 UC_EXTRA.36
5V
  Top 1.27: JD5.4 JD6.3 JD6.4 45.39,6.93 40.87,11.46 MQ6.1 | JD2.4 JD3.2 73.41,121.41 79.5,115.32 79.5,75.52 88.39,66.63 88.39,59.94 86.68,58.23 MQ4.1 | MQ6.1 MQ6.2 38.29,7.56 36.07,5.33 29.94,5.33 28.13,7.14 MQ5.2 MQ5.1 | U$5.5 35.99,30.05 40.13,25.91 40.13,15.49 38.29,13.65 MQ6.1 | U$4.12 31.52,63.37 29.21,61.06 29.21,50.8 22.35,43.94 22.35,37.08 26.85,32.59 U$5.6
  Top 2.54: U$5.5 U$5.6
  Bottom 1.27: U$4.12 39.6,58.09 MQ1.2 MQ1.1 56.79,58.09 MQ2.2 MQ2.1 70.3,58.05 MQ3.2 MQ3.1 82.34,58.1 MQ4.2 MQ4.1 95.17,58.23 103.38,66.43 103.38,105.92 U$3.12 95.76,113.54 95.76,123.7 98.81,126.75 U$2.12
11_1V_BATT
  Top 2.54: U$5.1 U$5.2
  Bottom 2.54: BATT_11_1.P 9.11,30.02 U$5.1
A1  (via drill 0.35)
  Top 0.508: U$2.10 91.95,113.54 v91.95,93.22
  Bottom 0.508: MQ1.7 50.87,69.34 69.09,69.34 91.95,92.2 v91.95,93.22
  Bottom 1.27: MQ1.7 MQ1.8
A2  (via drill 0.35)
  Top 0.508: U$2.8 95,111.51 95,92.2 v87,84.2
  Bottom 0.508: MQ2.7 59.37,65.72 61.06,67.41 70.21,67.41 v87,84.2
  Bottom 1.27: MQ2.7 MQ2.8
A3
  Bottom 0.508: U$3.10 99.15,104.14 95.1,100.08 95.1,88.44 72.89,66.22 MQ3.7
  Bottom 1.27: MQ3.7 MQ3.8
A4
  Bottom 0.508: U$3.8 99.41,99.06 97.94,97.6 97.94,73.7 90.09,65.85 MQ4.7
  Bottom 1.27: MQ4.8 MQ4.7
A5
  Top 1.27: MQ5.8 MQ5.7
  Bottom 0.508: MQ5.7 20.51,14.41 35.31,29.21 35.31,44.96 30.73,49.53 30.73,54.71 U$4.10
A6
  Top 1.27: MQ6.8 MQ6.7
  Bottom 0.508: MQ6.8 30.67,6.16 32.26,4.57 37.85,4.57 41.4,8.13 41.4,46.13 U$4.8
ADC_VREF
  Top 1.27: UC_SENZORI.35 JD1.6 JD2.11
ADC_VREF_2
  Top 1.27: UC_EXTRA.35 JD4.6 JD5.11
ADC_VREF_2_IN
  Top 1.27: JD6.12 JD6.11 JD5.12
ADC_VREF_OUT
  Top 1.27: JD3.6 JD2.12
AGND
  Top 1.27: UC_SENZORI.33 JD1.8 JD2.15
AGND_2
  Top 1.27: JD5.15 JD4.8 UC_EXTRA.33
CH0_MUX
  Top 0.508: MUX.1 U$2.3
CH1_MUX
  Top 0.508: MUX.2 U$2.4
CH2_MUX
  Top 0.508: MUX.3 U$2.5
CH3_MUX
  Top 0.508: MUX.4 U$2.6
CH4_MUX
  Bottom 0.508: MUX.5 88.39,113.03 88.39,105.66 U$3.3
CH5_MUX
  Bottom 0.508: MUX.6 86.87,112.01 86.87,104.65 U$3.4
CH6_MUX
  Top 0.508: MUX.7 88.39,107.95 88.39,100.58 U$3.5
CH7_MUX
  Top 0.508: MUX.8 87.38,106.43 87.38,99.06 U$3.6
CH8_MUX
  Bottom 0.508: MUX.9 77.98,106.17 73.15,101.35 73.15,79.5 67.11,73.46 34.59,73.46 26.42,65.28 26.42,60.55 U$4.3
CH9_MUX
  Bottom 0.508: U$4.4 24.41,55.75 27.69,59.03 27.69,64.01 36.07,72.39 67.56,72.39 74.07,78.89 74.07,98.45 79.25,103.63 MUX.10
CH10_MUX
  Bottom 0.508: MUX.11 80.77,101.09 74.93,95.25 74.93,78.23 68,71.3 37.52,71.3 28.96,62.74 28.96,58.01 U$4.5
CH11_MUX
  Bottom 0.508: U$4.6 30.23,56.74 30.23,62.23 38.33,70.33 68.56,70.33 75.95,77.72 75.95,91.95 82.55,98.55 MUX.12
CSB_BMP
  Top 1.27: BMP280.9 BMP280.10
D1  (via drill 0.35)
  Top 0.508: U$2.9 93.47,112.52 v93.47,94.49
  Bottom 0.508: MQ1.5 52.4,68.33 69.6,68.33 93.47,92.2 v93.47,94.49
  Bottom 1.27: MQ1.5 MQ1.6
D2  (via drill 0.35)
  Top 0.508: v84.58,79.76 96.5,91.67 96.5,108.18 100.08,111.76 U$2.7 | v73.66,68.83 68.83,68.83 v65.79,65.79
  Bottom 0.508: v84.58,79.76 v73.66,68.83 | v65.79,65.79 63.13,63.13 MQ2.5
  Bottom 1.27: MQ2.5 MQ2.6
D3
  Bottom 0.508: MQ3.5 96.52,86.81 96.52,98.71 99.41,101.6 U$3.9
  Bottom 1.27: MQ3.5 MQ3.6
D4
  Bottom 0.508: MQ4.5 92.77,63.31 100.08,70.61 U$3.7
  Bottom 1.27: MQ4.6 MQ4.5
D5
  Top 1.27: MQ5.6 MQ5.5
  Bottom 0.508: MQ5.5 23.05,14.16 36.83,27.94 36.83,45.72 32.26,50.29 32.26,53.69 U$4.9
D6
  Top 1.27: MQ6.6 MQ6.5
  Bottom 0.508: MQ6.5 33.21,21.53 38.61,26.92 38.61,46.38 U$4.7
EN_BMP280
  Top 1.27: JS2.19 JS3.10 14.22,101.09 12.42,99.29 12.42,93.45 BMP280.1 BMP280.2
EN_DHT22
  Top 1.27: JS2.1 JS3.1 13.72,123.95 11.56,126.11 DHT22.1
EN_MQ1  (via drill 0.35)
  Top 0.305: v13.25,54.98 13.21,54.93 13.21,51.9 R2.2
  Top 1.27: R1.2 R2.2 | JS2.33 JS3.17
  Bottom 0.305: JS3.17 10.16,83.31 4.84,77.99 4.84,68.97 13.25,60.56 v13.25,54.98
EN_MQ2  (via drill 0.35)
  Top 0.305: JS3.16 12.7,85.85 9.91,83.06 v9.91,79.5 | v16.19,59.93 16.19,57.25 R3.2
  Top 1.27: R4.2 R3.2 | JS2.31 JS3.16
  Bottom 0.305: v9.91,79.5 9.91,77.98 15.18,72.71 15.18,60.94 v16.19,59.93
EN_MQ3  (via drill 0.35)
  Top 0.305: JS3.15 12.7,88.39 8.13,83.82 v8.13,78.49 | v12.94,66 R6.2
  Top 1.27: R5.2 R6.2 | JS2.29 JS3.15
  Bottom 0.305: v8.13,78.49 8.13,77.98 13.91,72.2 13.91,66.96 v12.94,66
EN_MQ4
  Top 0.305: JS3.14 12.7,90.93 6.67,84.9 6.67,77.72 12.95,71.44 R8.2
  Top 1.27: R7.2 R8.2 | JS2.27 JS3.14
EN_MQ5  (via drill 0.35)
  Top 0.508: R10.2 21.48,23.98 18.54,26.92 v18.54,32.51
  Top 1.27: R9.2 R10.2 | JS2.39 JS3.20
  Bottom 0.508: JS2.39 18.54,75.44 v18.54,32.51
EN_MQ6  (via drill 0.35)
  Top 0.508: v20.07,32.51 20.07,29.21 22.86,26.42 29.21,26.42 31.62,24.01 R12.2
  Top 1.27: R11.2 R12.2 | JS2.37 JS3.19
  Bottom 0.508: JS2.37 20.07,76.96 v20.07,32.51
EN_MUX
  Top 0.508: JD3.7 67.31,108.71 MUX.19
  Top 1.27: JD3.7 JD2.14
EN_TSL2561
  Top 1.27: JS2.17 JS3.9 13.72,103.63 TSL2561.10 TSL2561.9
GND
  Top 1.27: JD5.16 JD6.15 JD6.16
  pour Top (isolate 0.254): -1.52,131.28 121.54,131.28 121.54,-1.8 -1.52,-1.8
  pour Bottom (isolate 0.254): -4.32,134.07 124.58,134.07 124.58,-4.84 -4.32,-4.84
GP0
  Top 1.27: UC_SENZORI.1 JS1.1 JS2.2
GP0_2
  Top 1.27: UC_EXTRA.1 JS4.1 JS5.2
GP0_2_OUT
  Top 1.27: JS5.1 JS6.2 JS6.1
GP1
  Top 1.27: JS2.4 JS1.2 UC_SENZORI.2
GP1_2
  Top 1.27: JS5.4 JS4.2 UC_EXTRA.2
GP1_2_OUT
  Top 1.27: JS5.3 JS6.4 JS6.3
GP2
  Top 1.27: UC_SENZORI.4 JS1.4 JS2.8
GP2_2
  Top 1.27: UC_EXTRA.4 JS4.4 JS5.8
GP2_2_OUT
  Top 1.27: JS5.7 JS6.8 JS6.7
GP3
  Top 1.27: UC_SENZORI.5 JS1.5 JS2.10
GP3_2
  Top 1.27: JS5.10 JS4.5 UC_EXTRA.5
GP3_2_OUT
  Top 1.27: JS5.9 JS6.10 JS6.9
GP4
  Top 1.27: UC_SENZORI.6 JS1.6 JS2.12
GP4_2
  Top 1.27: JS5.12 JS4.6 UC_EXTRA.6
GP4_2_OUT
  Top 1.27: JS5.11 JS6.12 JS6.11
GP4_OUT
  Top 1.27: JS2.11 JS3.6
GP5
  Top 1.27: UC_SENZORI.7 JS1.7 JS2.14
GP5_2
  Top 1.27: JS5.14 JS4.7 UC_EXTRA.7
GP5_2_OUT
  Top 1.27: JS5.13 JS6.14 JS6.13
GP5_OUT
  Top 1.27: JS2.13 JS3.7
GP6
  Top 1.27: UC_SENZORI.9 JS1.9 JS2.18
GP6_2
  Top 1.27: UC_EXTRA.9 JS4.9 JS5.18
GP6_2_OUT
  Top 1.27: JS5.17 JS6.18 JS6.17
GP7
  Top 1.27: UC_SENZORI.10 JS1.10 JS2.20
GP7_2
  Top 1.27: JS5.20 JS4.10 UC_EXTRA.10
GP7_2_OUT
  Top 1.27: JS5.19 JS6.20 JS6.19
GP8
  Top 1.27: UC_SENZORI.11 JS1.11 JS2.22
GP8_2
  Top 1.27: UC_EXTRA.11 JS4.11 JS5.22
GP8_2_OUT
  Top 1.27: JS5.21 JS6.22 JS6.21
GP9
  Top 1.27: UC_SENZORI.12 JS1.12 JS2.24
GP9_2
  Top 1.27: JS5.24 JS4.12 UC_EXTRA.12
GP9_2_OUT
  Top 1.27: JS5.23 JS6.24 JS6.23
GP10
  Top 1.27: UC_SENZORI.14 JS1.14 JS2.28
GP10_2
  Top 1.27: JS5.28 JS4.14 UC_EXTRA.14
GP10_2_OUT
  Top 1.27: JS5.27 JS6.28 JS6.27
GP11
  Top 1.27: UC_SENZORI.15 JS1.15 JS2.30
GP11_2
  Top 1.27: JS5.30 JS4.15 UC_EXTRA.15
GP11_2_OUT
  Top 1.27: JS5.29 JS6.30 JS6.29
GP12
  Top 1.27: UC_SENZORI.16 JS1.16 JS2.32
GP12_2
  Top 1.27: JS5.32 JS4.16 UC_EXTRA.16
GP12_2_OUT
  Top 1.27: JS5.31 JS6.32 JS6.31
GP13
  Top 1.27: UC_SENZORI.17 JS1.17 JS2.34
GP13_2
  Top 1.27: JS5.34 JS4.17 UC_EXTRA.17
GP13_2_OUT
  Top 1.27: JS5.33 JS6.34 JS6.33
GP14
  Top 1.27: UC_SENZORI.19 JS1.19 JS2.38
GP14_2
  Top 1.27: JS5.38 JS4.19 UC_EXTRA.19
GP14_2_OUT
  Top 1.27: JS5.37 JS6.38 JS6.37
GP15
  Top 1.27: UC_SENZORI.20 JS1.20 JS2.40
GP15_2
  Top 1.27: JS5.40 JS4.20 UC_EXTRA.20
GP15_2_OUT
  Top 1.27: JS5.39 JS6.40 JS6.39
GP16
  Top 1.27: UC_SENZORI.21 JD1.20 JD2.39
GP16_2
  Top 1.27: UC_EXTRA.21 JD4.20 JD5.39
GP17
  Top 1.27: UC_SENZORI.22 JD1.19 JD2.37
GP17_2
  Top 1.27: UC_EXTRA.22 JD4.19 JD5.37
GP18
  Top 1.27: UC_SENZORI.24 JD1.17 JD2.33
GP18_2
  Top 1.27: UC_EXTRA.24 JD4.17 JD5.33
GP18_2_OUT
  Top 1.27: JD5.34 JD6.33 JD6.34
GP19
  Top 1.27: UC_SENZORI.25 JD1.16 JD2.31
GP19_2
  Top 1.27: JD5.31 JD4.16 UC_EXTRA.25
GP19_2_OUT
  Top 1.27: JD6.32 JD6.31 JD5.32
GP20
  Top 1.27: UC_SENZORI.26 JD1.15 JD2.29
GP20_2
  Top 1.27: JD5.29 JD4.15 UC_EXTRA.26
GP20_2_OUT
  Top 1.27: JD6.30 JD6.29 JD5.30
GP21
  Top 1.27: UC_SENZORI.27 JD1.14 JD2.27
GP21_2
  Top 1.27: JD5.27 JD4.14 UC_EXTRA.27
GP21_2_OUT
  Top 1.27: JD6.28 JD6.27 JD5.28
GP22
  Top 1.27: UC_SENZORI.29 JD1.12 JD2.23
GP22_2
  Top 1.27: UC_EXTRA.29 JD4.12 JD5.23
GP22_2_OUT
  Top 1.27: JD6.24 JD5.24 JD6.23
GP22_OUT
  Top 1.27: JD3.12 JD2.24
GP26
  Top 1.27: UC_SENZORI.31 JD1.10 JD2.19
GP26_2
  Top 1.27: UC_EXTRA.31 JD4.10 JD5.19
GP26_2_OUT
  Top 1.27: JD5.20 JD6.19 JD6.20
GP27
  Top 1.27: UC_SENZORI.32 JD1.9 JD2.17
GP27_2
  Top 1.27: UC_EXTRA.32 JD4.9 JD5.17
GP27_2_OUT
  Top 1.27: JD6.18 JD6.17 JD5.18
GP28
  Top 1.27: UC_SENZORI.34 JD1.7 JD2.13
GP28_2
  Top 1.27: UC_EXTRA.34 JD4.7 JD5.13
GP28_2_OUT
  Top 1.27: JD6.14 JD6.13 JD5.14
INT_TSL
  Top 1.27: TSL2561.2 TSL2561.1
MQ1_DRAIN
  Top 0.508: U$1.3 MQ1.4
  Bottom 1.27: MQ1.3 MQ1.4
MQ2_DRAIN
  Top 0.508: U$7.3 56.8,60.56 MQ2.4
  Bottom 1.27: MQ2.3 MQ2.4
MQ3_DRAIN
  Top 0.508: U$8.3 70.33,60.62 MQ3.4
  Bottom 1.27: MQ3.3 MQ3.4
MQ4_DRAIN
  Top 0.508: U$9.3 82.45,60.74 MQ4.4
  Bottom 1.27: MQ4.4 MQ4.3
MQ5_DRAIN
  Top 0.508: MQ5.3 U$10.3
  Top 1.27: MQ5.4 MQ5.3
MQ6_DRAIN
  Top 0.508: MQ6.3 U$11.3
  Top 1.27: MQ6.4 MQ6.3
N$121
  Top 0.305: R1.1 18.03,53.65 21.38,57 21.38,64.75 24.31,67.68 32.76,67.68 38.86,61.58 U$1.1
N$186
  Top 0.305: R3.1 18.06,59.26 19.95,61.16 19.95,65.58 25.24,70.87 47.24,70.87 52.37,65.74 U$7.1
N$189
  Top 0.305: R5.1 18.03,65.21 24.7,71.88 56.9,71.88 65.65,63.13 U$8.1
N$277
  Top 0.305: R7.1 19.8,68.56 24.01,72.77 71.75,72.77 77.85,66.67 U$9.1
N$332
  Top 0.508: R9.1 26.56,15.95 U$10.1
N$338
  Top 0.508: R11.1 U$11.1 | U$11.1
OUT_DHT
  Top 1.27: JS2.3 JS3.2 13.72,121.41 11.56,123.57 DHT22.2
RUN
  Top 1.27: UC_SENZORI.30 JD1.11 JD2.21
RUN_2
  Top 1.27: UC_EXTRA.30 JD4.11 JD5.21
RUN_IN
  Top 1.27: JD3.11 JD2.22
RUN_IN_2
  Top 1.27: JD6.22 JD6.21 JD5.22
S0_MUX
  Top 0.406: MUX.20 67.82,106.68 67.82,91.44 67.31,90.93
  Top 0.508: 67.31,90.93 JD3.14 JD2.28
S1_MUX
  Top 0.508: MUX.21 74.17,101.85 74.17,94.23 68.33,88.39 JD3.15
  Top 1.27: JD3.15 JD2.30
S2_MUX  (via drill 0.35)
  Top 0.508: v70.36,85.85 JD3.16
  Top 1.27: JD3.16 JD2.32
  Bottom 0.508: MUX.22 72.14,101.35 72.14,87.63 v70.36,85.85
S3_MUX
  Top 1.27: JD3.17 JD2.34
  Bottom 0.508: MUX.23 71.12,99.82 71.12,88.39 66.04,83.31 JD3.17
SCL_BMP
  Top 1.27: BMP280.5 BMP280.6 | JS2.23 JS3.12
  Bottom 1.27: BMP280.5 JS3.12
SCL_TSL
  Top 1.27: JS2.9 JS3.5 11.18,113.79 TSL2561.6 TSL2561.5
SDA_BMP
  Top 1.27: BMP280.7 BMP280.8 | JS2.21 JS3.11
  Bottom 1.27: JS3.11 BMP280.7
SDA_TSL
  Top 1.27: JS2.7 JS3.4 11.18,116.33 TSL2561.4 TSL2561.3
SDO_BMP
  Top 1.27: BMP280.11 BMP280.12
SIG_ADC
  Top 1.27: JD3.10 JD3.9 JD2.18 JD2.20
  Bottom 1.27: MUX.24 67.31,101.09 JD3.10
UART0_RX
  Top 1.27: JD3.19 JD2.38
UART0_RX_2
  Top 1.27: JD5.38 JD6.37 JD6.38
UART0_TX
  Top 1.27: JD3.20 JD2.40
UART0_TX_2
  Top 1.27: JD5.40 JD6.39 JD6.40
VBUS
  Top 1.27: UC_SENZORI.40 JD1.1 JD2.1
VBUS_2
  Top 1.27: JD5.1 JD4.1 UC_EXTRA.40
VBUS_2_OUT
  Top 1.27: JD6.2 JD6.1 JD5.2
VBUS_OUT
  Top 1.27: JD3.1 JD2.2
VSYS
  Top 1.27: UC_SENZORI.39 JD1.2 JD2.3
VSYS_2
  Top 1.27: UC_EXTRA.39 JD4.2 JD5.3

### Text on the board
tNames: Buck_5V | Curea Andrei-Marian / Grupa 442C | Placa_Senzori
tValues: LVL_SHIFTR | LVL_SHIFTR | CD74HC4067_16_CH_MUX | LVL_SHIFTR